# EAGLE design daclock-2.1 (EAGLE 8.0.1)
PROJECT_AUTHOR: tinkerman.cat <xose.perez@gmail.com>; PROJECT_LICENSE: CC-BY-SA-NC 3.0; PROJECT_NAME: DACLOCK WIFI; PROJECT_VERSION: 2.1.20160621
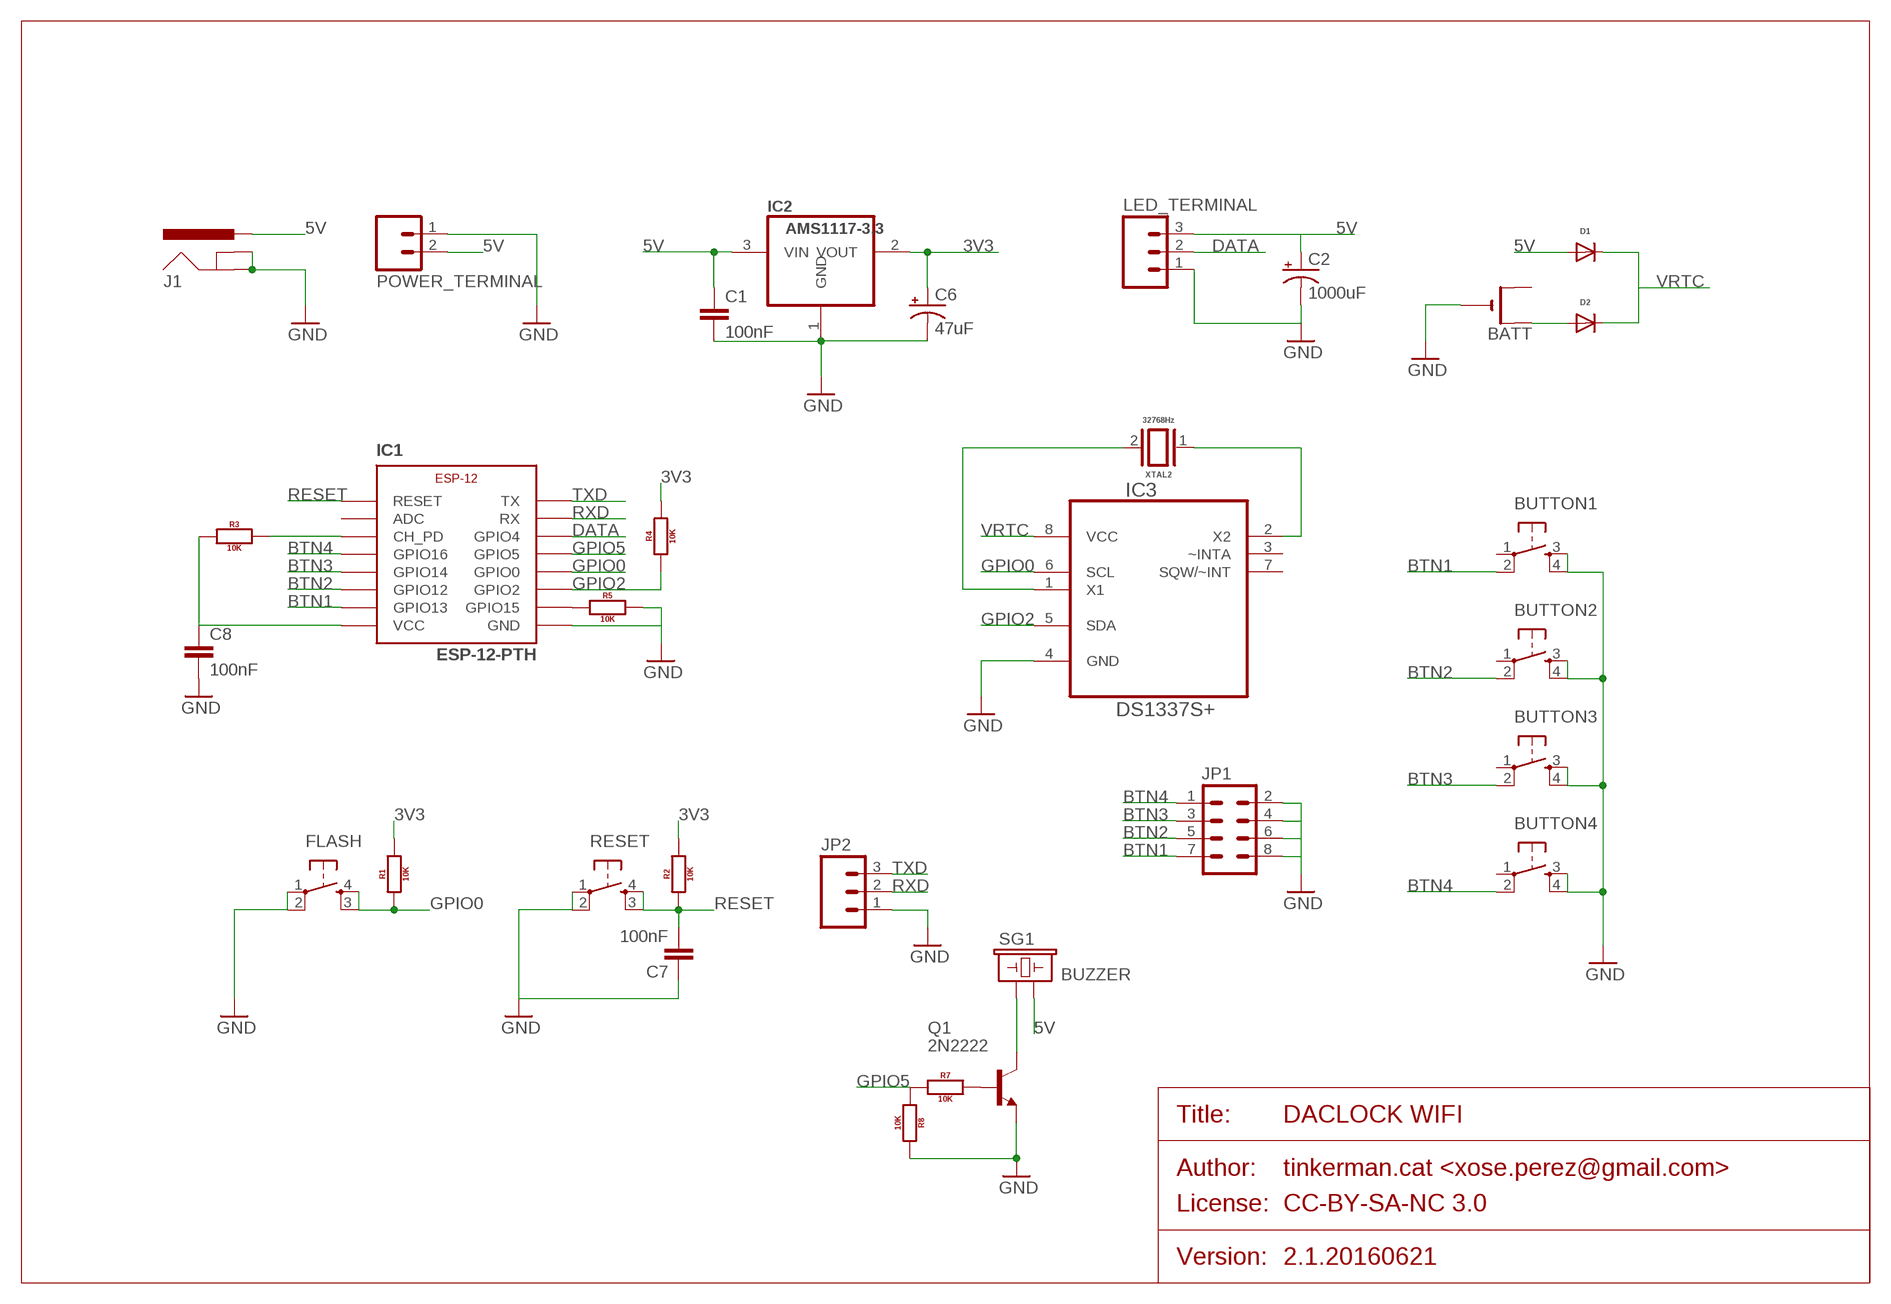
[diagram p0: schematic, sheet 1]

## Parts
BATT  CR2032SMT  [CR2032-SMD]
BUTTON1  BTN1  TACTILE_BUTTON_PTH  [TACTILE-BUTTON]
BUTTON2  BTN2  TACTILE_BUTTON_PTH  [TACTILE-BUTTON]
BUTTON3  BTN3  TACTILE_BUTTON_PTH  [TACTILE-BUTTON]
BUTTON4  BTN4  TACTILE_BUTTON_PTH  [TACTILE-BUTTON]
C1  100nF  C-EU050-025X075  [C050-025X075]
C2  1000uF  CAP_POLG  [PANASONIC_G]
C6  47uF  CAP_POLPTH2  [CPOL-RADIAL-10UF-25V]
C7  100nF  C-EU050-025X075  [C050-025X075]
C8  100nF  C-EU050-025X075  [C050-025X075]
D1  DIODE-PTH4  [AXIAL-0.4-DIODE]
D2  DIODE-PTH4  [AXIAL-0.4-DIODE]
FLASH  TACTILE_BUTTON_SMD  [TACTILE-BUTTON-SMD]
IC1  ESP-12-PTH  [ESP-12-PTH]
IC2  AMS1117-3.3  REG1117  [SOT223]
IC3  DS1337S+  [SOIC127P600X175-8N]
J1  POWER_JACKPTH  [POWER_JACK_PTH]
JP1  M04X2  [2X4]
JP2  M03PTH  [1X03]
LED_TERMINAL  M03200MIL  [SCREWTERMINAL-200MIL-3]
POWER_TERMINAL  M02200MIL  [SCREWTERMINAL-200MIL-2]
Q1  2N2222  [TO92-EBC-OVAL]
R1  10K  RESISTORPTH-400MIL  [AXIAL-0.4]
R2  10K  RESISTORPTH-400MIL  [AXIAL-0.4]
R3  10K  RESISTORPTH-400MIL  [AXIAL-0.4]
R4  10K  RESISTORPTH-400MIL  [AXIAL-0.4]
R5  10K  RESISTORPTH-400MIL  [AXIAL-0.4]
R7  10K  RESISTORPTH-400MIL  [AXIAL-0.4]
R8  10K  RESISTORPTH-400MIL  [AXIAL-0.4]
RESET  TACTILE_BUTTON_SMD  [TACTILE-BUTTON-SMD]
SG1  BUZZER  BUZZERPTH  [BUZZER-12MM]
XTAL2  32768Hz  CRYSTAL_TC38H  [TC38H]

## Nets
3V3: C6.1(+) C8.1 IC1.VCC IC2.2(VOUT) R1.P$2 R2.P$2 R3.P$1 R4.P$2
5V: C1.1 C2.+ D1.A IC2.3(VIN) J1.PWR LED_TERMINAL.3 POWER_TERMINAL.2 SG1.-
BTN1: BUTTON1.2(SWB1) IC1.GPIO13 JP1.7
BTN2: BUTTON2.2(SWB1) IC1.GPIO12 JP1.5
BTN3: BUTTON3.2(SWB1) IC1.GPIO14 JP1.3
BTN4: BUTTON4.2(SWB1) IC1.GPIO16 JP1.1
DATA: IC1.GPIO4 LED_TERMINAL.2
GND: BATT.- BUTTON1.3(SWA2) BUTTON1.4(SWB2) BUTTON2.3(SWA2) BUTTON2.4(SWB2) BUTTON3.3(SWA2) BUTTON3.4(SWB2) BUTTON4.3(SWA2) BUTTON4.4(SWB2) C1.2 C2.- C6.2(-) C7.1 C8.2 FLASH.1(SWA1) FLASH.2(SWB1) IC1.GND IC2.1(GND) IC3.4(GND) J1.GND J1.GNDBREAK JP1.2 JP1.4 JP1.6 JP1.8 JP2.1 LED_TERMINAL.1 POWER_TERMINAL.1 Q1.E R5.P$2 R8.P$2 RESET.1(SWA1) RESET.2(SWB1)
GPIO0: FLASH.3(SWB2) FLASH.4(SWA2) IC1.GPIO0 IC3.6(SCL) R1.P$1
GPIO2: IC1.GPIO2 IC3.5(SDA) R4.P$1
GPIO5: IC1.GPIO5 R7.P$1 R8.P$1
N$1: Q1.B R7.P$2
N$2: IC3.1(X1) XTAL2.2
N$3: IC3.2(X2) XTAL2.1
N$4: BATT.+$1(+) D2.A
N$6: IC1.CH_PD R3.P$2
N$8: IC1.GPIO15 R5.P$1
N$10: Q1.C SG1.+
RESET: C7.2 IC1.RESET R2.P$1 RESET.3(SWB2) RESET.4(SWA2)
RXD: IC1.RX JP2.2
TXD: IC1.TX JP2.3
VRTC: D1.C D2.C IC3.8(VCC)
Unconnected: BATT.+$2(+1) BUTTON1.1(SWA1) BUTTON2.1(SWA1) BUTTON3.1(SWA1) BUTTON4.1(SWA1) IC1.ADC IC3.3(~INTA) IC3.7(SQW/~INT)

## Library data of the parts
BATT = xose:CR2032
BUTTON1-BUTTON4 FLASH RESET = xose:TACTILE_BUTTON: Tactile Button SparkFun Electronics' Tactile Button COM-10302
C1 C7 C8 = xose:C-EU: CAPACITOR, European symbol
C2 C6 = xose:CAP_POL: Capacitor Polarized These are standard SMD and PTH capacitors. Normally 10uF, 47uF, and 100uF in electrolytic and tantalum varieties. Always verify the external diameter of the through hole cap, it varies with capacity, voltage, and manufacturer. The EIA devices should be standard.
D1 D2 = xose:DIODE
IC1 = xose:ESP-12
IC2 = xose:REG1117: 800mA and 1A Low Dropout (LDO) Positive Regulator 1.8V, 2.5V, 2.85V, 3.3V, 5V, and Adj; MPN: REG1117; OC_FARNELL: 1097566; OC_NEWARK: 14P6981
IC3 = xose:DS1337S+: 64 x 8, Serial, I2C Real-Time Clock; MPN: DS1337S+; OC_FARNELL: 1379748; OC_NEWARK: 08J6237; PACKAGE: SOIC-8; SUPPLIER: Maxim
J1 = xose:POWER_JACK: Power Jack This is the standard 5.5mm barrel jack for power. The PTH is the most common, proven, reliable, footprint. The Slot footprint only works if the mill layer is transmitted to the PCB fab house so be warned. Mating wall wart : TOL-00298 (and others); PROD_ID: CONN-08197
JP1 = xose:M04X2: .1" header, two rows of four.
JP2 LED_TERMINAL = xose:M03: Header 3 Standard 3-pin 0.1" header. Use with straight break away headers (SKU : PRT-00116), right angle break away headers (PRT-00553), swiss pins (PRT-00743), machine pins (PRT-00117), and female headers (PRT-00115). Molex polarized connector foot print use with SKU : PRT-08232 with associated crimp pins and housings.
POWER_TERMINAL = xose:M02: Standard 2-pin 0.1" header. Use with - straight break away headers ( PRT-00116) - right angle break away headers (PRT-00553) - swiss pins (PRT-00743) - machine pins (PRT-00117) - female headers (PRT-00115) Molex polarized connector foot print use with: PRT-08233 with associated crimp pins and housings. 2.54_SCREWTERM for use with PRT-10571. 3.5mm Screw Terminal footprints for PRT-08084 5mm Screw Terminal footprints for use with PRT-08432
Q1 = xose:2N2222: NPN TRANSISTOR Big oval pads
R1-R5 R7 R8 = xose:RESISTOR: Generic EU resistor symbol
SG1 = SparkFun-Electromechanical:BUZZER: Buzzer 12mm Spark Fun Electronics SKU : Comp-Buzzer
XTAL2 = xose:CRYSTAL_TC38H

## Board
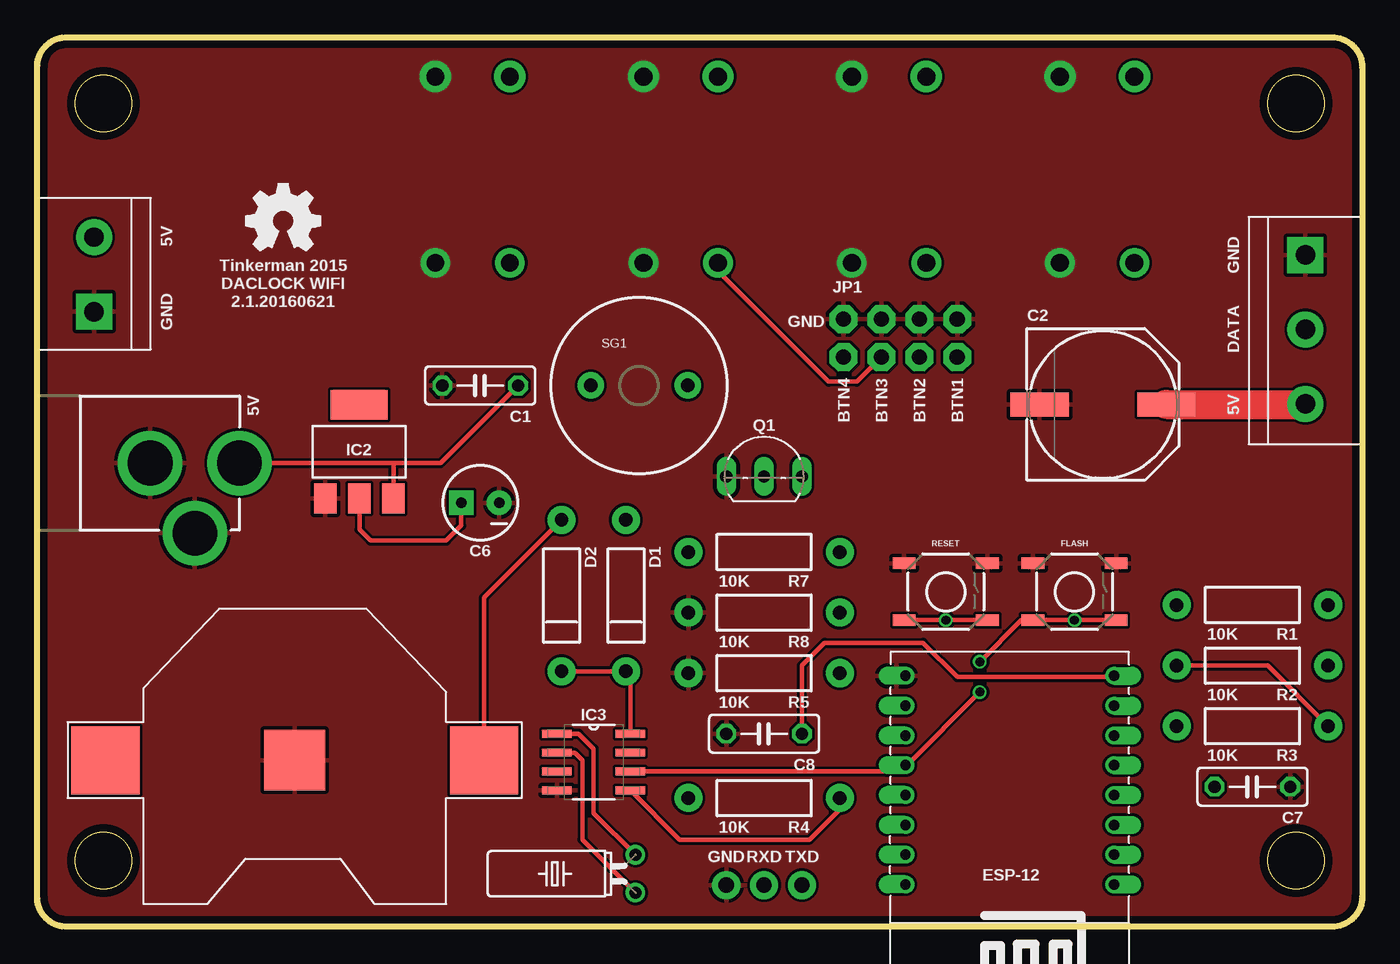
[diagram p1: board, top side]
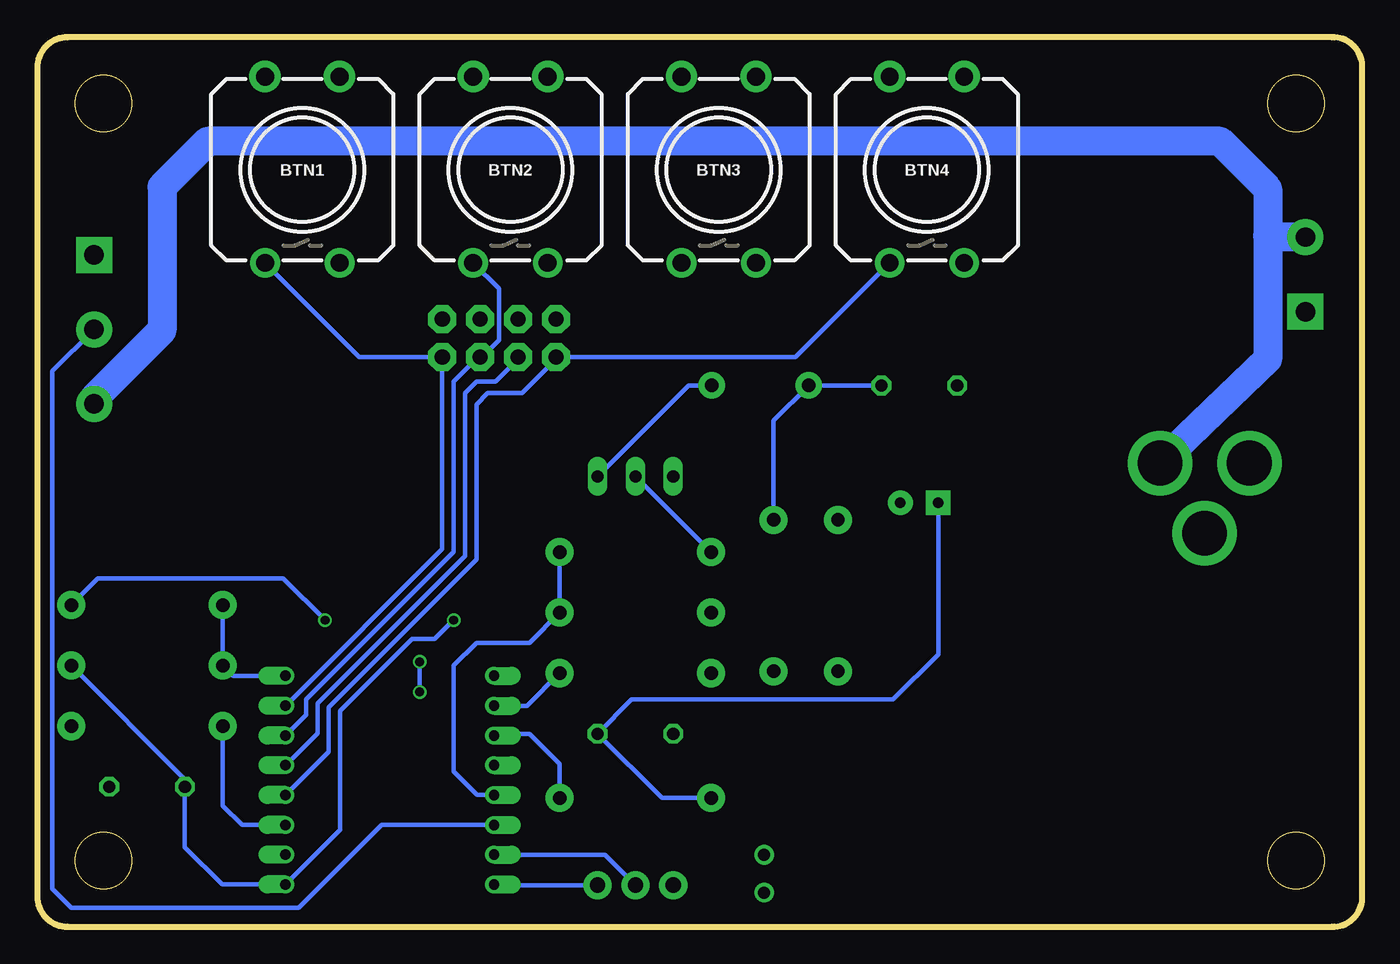
[diagram p2: board, bottom side, seen from below]

Size 88.9 x 59.69 mm. Coordinates in mm from the lower left corner, seen from the top.
Outline: 86.87,0 2.03,0 arc-90 0,1.91 0,57.78 arc-90 2.03,59.69 86.87,59.69 arc-90 88.9,57.66 88.9,2.03 arc-90 86.87,0
Outline: circle at 4.45,55.24 radius 1.91
Outline: circle at 4.45,4.45 radius 1.91
Outline: circle at 84.45,55.24 radius 1.91
Outline: circle at 84.45,4.45 radius 1.91
Copper layers (1*16): Top 0.035mm / dielectric 1.5mm / Bottom 0.035mm
Design rules "smart-prototyping": minimum track width 7mil, minimum drill 12mil, track to track 7mil, track to pad 7mil, pad to pad 7mil, via to via 7mil, smd to smd 0mil, copper to edge 20mil, drill to drill 10mil, minimum pad ring 10mil, minimum via ring 6mil, stop-mask expansion 2mil, vias tented up to drill 25mil, thermal gap 10mil

### Footprints (pad centres in the part's own frame; a part is rotated, then mirrored left to right if it is on the bottom)
CR2032-SMD = smd 4.572 x 4.572: +$1 -12.7,0; +$2 12.7,0 | smd 4.064 x 4.064: - 0,0
TACTILE-BUTTON = drill 1.2 pad 2.1: 1 -2.5,6.25; 3 2.5,6.25 | drill 1.2 pad 2: 2 -2.5,-6.25; 4 2.5,-6.25
C050-025X075 = drill 0.813 octagon: 1 -2.54,0; 2 2.54,0
PANASONIC_G = smd 3.9 x 1.6: + 4.25,0; - -4.25,0
CPOL-RADIAL-10UF-25V = drill 0.7 pad 1.651 square: 1 1.27,0 | drill 0.7 pad 1.651: 2 -1.27,0
AXIAL-0.4-DIODE = drill 0.9 pad 1.88: A -5.08,0; C 5.08,0
TACTILE-BUTTON-SMD = smd 1.524 x 0.762: 1 -2.794,1.905; 2 2.794,1.905; 3 -2.794,-1.905; 4 2.794,-1.905
ESP-12-PTH = drill 0.7 offset: ADC -6.465,5.07; CH_PD -6.465,3.07; GND 7.535,-6.93; GPIO0 7.535,-0.93; GPIO2 7.535,-2.93; GPIO4 7.535,3.07; GPIO5 7.535,1.07; GPIO12 -6.465,-2.93; GPIO13 -6.465,-4.93; GPIO14 -6.465,-0.93; GPIO15 7.535,-4.93; GPIO16 -6.465,1.07; RESET -6.465,7.07; RX 7.535,5.07; TX 7.535,7.07; VCC -6.465,-6.93
SOT223 = smd 1.499 x 2.007: 1 -2.261,-3.15; 2 0.025,-3.15; 3 2.311,-3.15 | smd 3.81 x 2.007: 4 0,3.15
SOIC127P600X175-8N = smd 1.981 x 0.533: 1 -2.464,1.905; 2 -2.464,0.635; 3 -2.464,-0.635; 4 -2.464,-1.905; 5 2.464,-1.905; 6 2.464,-0.635; 7 2.464,0.635; 8 2.464,1.905
POWER_JACK_PTH = drill 2.997 pad 4.318: GND 0,7.7; GNDBREAK 4.7,10.7; PWR 0,13.7
2X4 = drill 1.016 pad 1.88 octagon: 1 -3.81,-1.27; 2 -3.81,1.27; 3 -1.27,-1.27; 4 -1.27,1.27; 5 1.27,-1.27; 6 1.27,1.27; 7 3.81,-1.27; 8 3.81,1.27
1X03 = drill 1.016 pad 1.88: 1 0,0; 2 2.54,0; 3 5.08,0
SCREWTERMINAL-200MIL-3 = drill 1.3 pad 2.413 square: 1 0,0 | drill 1.3 pad 2.413: 2 5,0; 3 10,0
SCREWTERMINAL-200MIL-2 = drill 1.3 pad 2.413 square: 1 0,0 | drill 1.3 pad 2.413: 2 5,0
TO92-EBC-OVAL = drill 0.813 long: B 0,-1.27; C 2.54,-1.27; E -2.54,-1.27
AXIAL-0.4 = drill 0.9 pad 1.88: P$1 -5.08,0; P$2 5.08,0
BUZZER-12MM = drill 0.9 pad 1.778: + 3.25,0; - -3.25,0
TC38H = drill 0.813: 1 -1.27,0; 2 1.27,0

### Placement (x,y rotation side)
BATT  17.27,11.18 180 top
BUTTON1  71.12,50.8 0 bottom
BUTTON2  57.15,50.8 0 bottom
BUTTON3  43.18,50.8 0 bottom
BUTTON4  29.21,50.8 0 bottom
C1  29.72,36.32 180 top
C2  71.5,35.05 0 top
C6  29.72,28.45 180 top
C7  81.53,9.4 180 top
C8  48.77,12.95 180 top
D1  39.5,22.23 270 top
D2  35.18,22.23 270 top
FLASH  69.6,22.48 0 top
IC1  65.79,9.91 180 top
IC2  21.59,31.88 0 top
IC3  37.34,11.05 0 top
J1  -0.13,31.11 270 top
JP1  57.91,39.5 0 top
JP2  46.23,2.79 0 top
LED_TERMINAL  85.09,45.09 270 top
POWER_TERMINAL  3.81,41.27 90 top
Q1  48.77,31.5 0 top
R1  81.53,21.59 180 top
R2  81.53,17.53 180 top
R3  81.53,13.46 180 top
R4  48.77,8.64 180 top
R5  48.77,17.02 180 top
R7  48.77,25.15 180 top
R8  48.77,21.08 180 top
RESET  60.96,22.48 0 top
SG1  40.39,36.32 0 top
XTAL2  40.13,3.56 90 top

### Tracks (layer width: path | path; a pad name or v marks a point on that pad's centre or on a via)
3V3
  Top 0.305: R2.P$2 82.55,17.53 R3.P$1 | C8.1 51.31,17.53 52.83,19.05 59.44,19.05 61.72,16.76 72.18,16.76 IC1.VCC | IC2.2 21.61,26.64 22.35,25.91 27.43,25.91 28.45,26.92 C6.1
  Bottom 0.305: R4.P$2 46.99,8.64 C8.1 49.02,15.24 31.5,15.24 28.45,18.29 C6.1 | IC1.VCC 75.76,16.84 R2.P$2 R1.P$2
5V
  Top 0.305: 85.06,35.05 LED_TERMINAL.3 | J1.PWR 23.88,31.11 | 23.88,31.11 27.05,31.11 C1.1 | 23.88,28.75 IC2.3 23.9,31.09 23.88,31.11
  Top 1.93: C2.+ 85.06,35.05
  Bottom 0.305: D1.A 39.5,33.96 SG1.- C1.1
  Bottom 1.93: 6.35,46.35 6.35,49.53 9.53,52.7 77.47,52.7 80.52,49.66 80.52,40.04 85.09,35.47 LED_TERMINAL.3 | 6.35,46.35 6.35,38.08 J1.PWR | POWER_TERMINAL.2 6.27,46.27 6.35,46.35
BTN1
  Bottom 0.305: BUTTON1.2 67.3,38.23 JP1.7 61.72,25.36 IC1.GPIO13
BTN2
  Bottom 0.305: BUTTON2.2 57.91,42.81 57.91,39.37 59.05,38.23 JP1.5 59.31,38.23 60.96,36.58 60.96,25.15 70.87,15.24 70.87,14.22 IC1.GPIO12
BTN3
  Top 0.305: JP1.3 54.99,36.58 53.09,36.58 45.68,43.98 BUTTON3.2
  Bottom 0.305: IC1.GPIO14 70.1,12.98 70.1,14.99 60.2,24.89 60.2,35.81 59.44,36.58 58.17,36.58 56.64,38.1 JP1.3
BTN4
  Bottom 0.305: BUTTON4.2 38.03,38.23 JP1.1 54.1,38.1 56.39,35.81 58.67,35.81 59.44,35.05 59.44,24.64 69.34,14.73 69.34,11.74 IC1.GPIO16
DATA
  Bottom 0.305: IC1.GPIO4 65.81,6.84 71.37,1.27 86.61,1.27 87.88,2.54 87.88,37.29 LED_TERMINAL.2
GND
  pour Top: 0,59.69 88.9,59.69 88.9,0 0,0
GPIO0  (via drill 0.6)
  Top 0.305: IC3.6 57.83,10.41 IC1.GPIO0 58.33,10.84 v63.25,15.75 | FLASH.4 v69.6,20.57 FLASH.3 66.04,20.57 v63.25,17.78
  Bottom 0.305: v63.25,15.75 v63.25,17.78 | R1.P$1 84.84,23.37 72.39,23.37 v69.6,20.57
GPIO2
  Top 0.305: IC3.5 43.1,5.84 51.82,5.84 53.85,7.87 R4.P$1
  Bottom 0.305: R4.P$1 53.85,10.92 55.88,12.95 58.13,12.95 IC1.GPIO2
GPIO5
  Bottom 0.305: R7.P$1 R8.P$1 55.88,19.05 59.44,19.05 60.96,17.53 60.96,10.41 59.38,8.84 IC1.GPIO5
N$1
  Bottom 0.305: Q1.B R7.P$2
N$2
  Top 0.305: IC3.1 36.32,12.95 37.34,11.94 37.34,7.62 XTAL2.2
N$3
  Top 0.305: IC3.2 36.07,11.68 36.58,11.18 36.58,5.84 XTAL2.1
N$4
  Top 0.305: BATT.+$1 29.97,22.1 D2.A
N$6
  Bottom 0.305: IC1.CH_PD 75.16,6.84 76.45,8.13 R3.P$2
N$8
  Bottom 0.305: R5.P$1 56.03,14.84 IC1.GPIO15
N$10
  Bottom 0.305: SG1.+ 45.21,36.32 Q1.C
RESET  (via drill 0.6)
  Top 0.305: RESET.4 v60.96,20.57 RESET.3
  Bottom 0.305: R2.P$1 78.99,9.91 C7.2 78.99,5.33 76.5,2.84 IC1.RESET 68.58,6.51 68.58,14.48 63.75,19.3 62.23,19.3 v60.96,20.57
RXD
  Bottom 0.305: IC1.RX 50.81,4.84 JP2.2
TXD
  Bottom 0.305: IC1.TX 58.21,2.79 JP2.3
VRTC
  Top 0.305: IC3.8 39.8,16.84 D1.C D2.C

### Text on the board
tPlace: 5V | GND | Tinkerman 2015 / DACLOCK WIFI / 2.1.20160621 | GND | GND | DATA | BTN4 | BTN3 | BTN2 | BTN1 | 5V | 5V | GND | RXD | TXD